# EAGLE design frankShield-v2 (EAGLE 7.5.0)
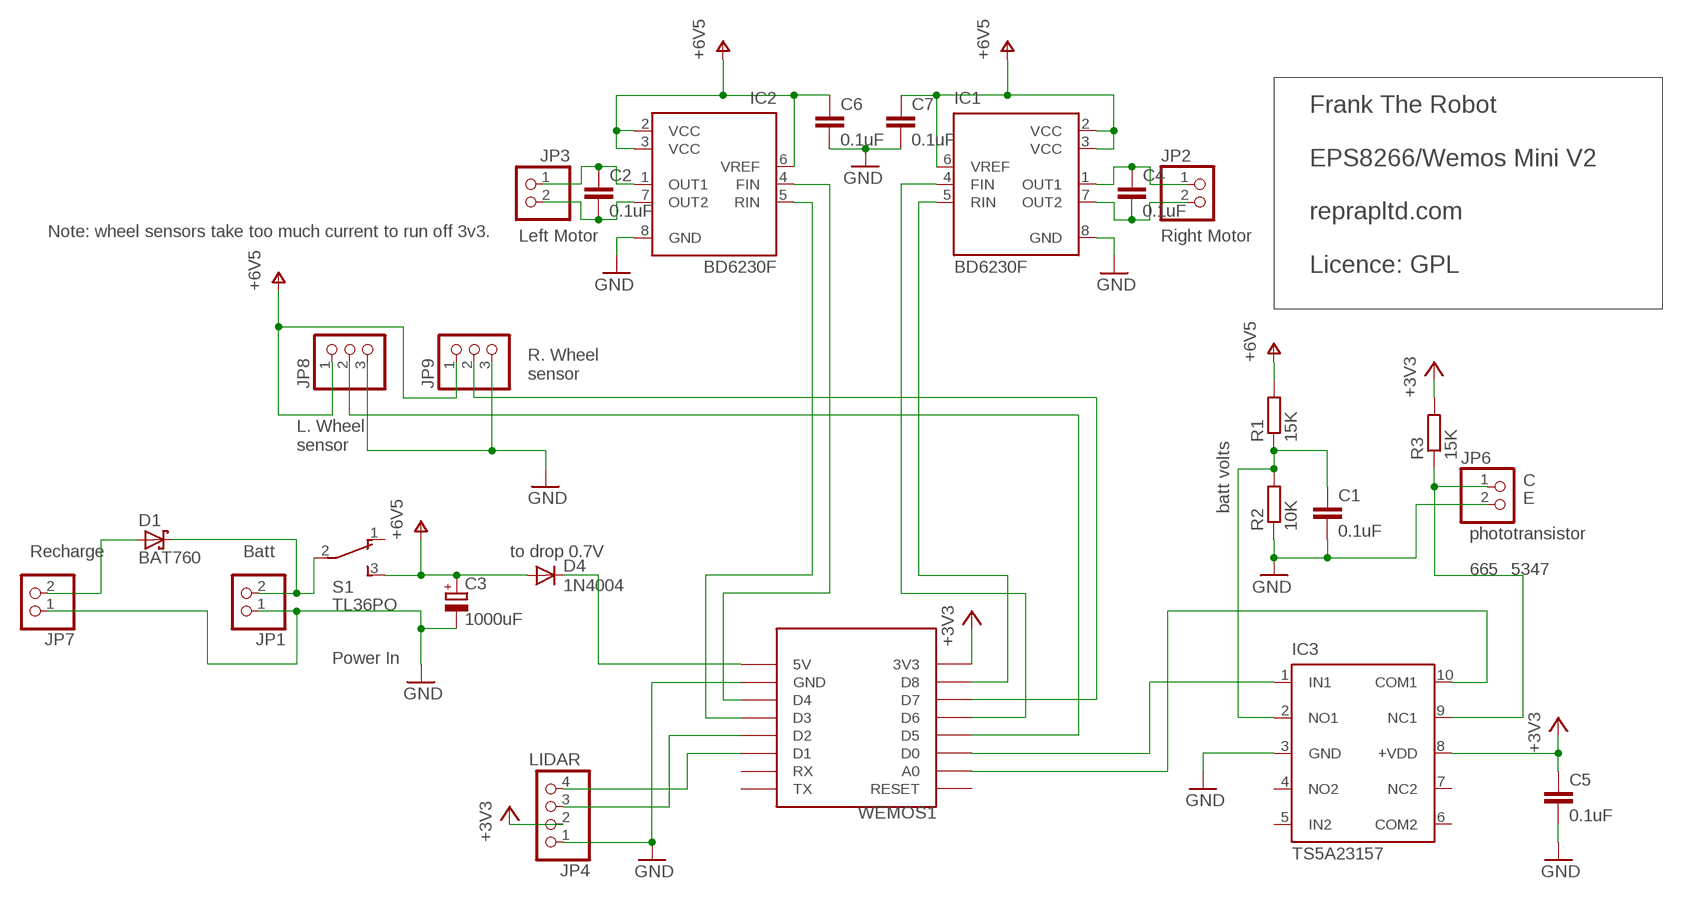
[diagram p0: schematic, sheet 1]

## Parts
C1  0.1uF  C-EUC0805  [C0805]
C2  0.1uF  C-EUC0805  [C0805]
C3  1000uF  CPOL-EUB45181B  [B45181B]
C4  0.1uF  C-EUC0805  [C0805]
C5  0.1uF  C-EUC0805  [C0805]
C6  0.1uF  C-EUC0805  [C0805]
C7  0.1uF  C-EUC0805  [C0805]
D1  BAT760  BAT60J  [SOD323_ST]
D4  1N4004  [DO41-10]
IC1  BD6230F  [SOP8]
IC2  BD6230F  [SOP8]
IC3  TS5A23157  [MSOP10]
JP1  PINHD-1X2  [1X02]
JP2  PINHD-1X2  [1X02]
JP3  PINHD-1X2  [1X02]
JP4  PINHD-1X4  [1X04]
JP6  PINHD-1X2  [1X02]
JP7  PINHD-1X2  [1X02]
JP8  PINHD-1X3  [1X03]
JP9  PINHD-1X3  [1X03]
R1  15K  R-EU_M0805  [M0805]
R2  10K  R-EU_M0805  [M0805]
R3  15K  R-EU_M0805  [M0805]
S1  TL36PO  [TL3XPO]
WEMOS1  WEMOS-D1-MINI  [WEMOS-D1-MINI]

## Nets
+3V3: C5.1 IC3.8(+VDD) JP4.2 R3.2 WEMOS1.3V3
GND: C1.2 C3.- C5.2 C6.2 C7.2 IC1.8(GND) IC2.8(GND) IC3.3(GND) JP1.1 JP4.1 JP6.2 JP7.1 JP8.3 JP9.3 R2.1 WEMOS1.GND
N$1: JP4.4 WEMOS1.D1
N$2: JP4.3 WEMOS1.D2
N$3: C2.1 IC2.1(OUT1) JP3.1
N$4: C2.2 IC2.7(OUT2) JP3.2
N$5: C4.1 IC1.1(OUT1) JP2.1
N$6: C4.2 IC1.7(OUT2) JP2.2
N$7: IC2.4(FIN) WEMOS1.D4
N$8: IC2.5(RIN) WEMOS1.D3
N$9: IC1.4(FIN) WEMOS1.D6
N$10: IC1.5(RIN) WEMOS1.D8
N$11: IC3.10(COM1) WEMOS1.A0
N$12: C1.1 IC3.2(NO1) R1.1 R2.2
N$13: D1.C JP1.2 S1.2(P)
N$14: IC3.9(NC1) JP6.1 R3.1
N$15: IC3.1(IN1) WEMOS1.D0
N$16: D1.A JP7.2
N$17: JP9.2 WEMOS1.D7
N$18: JP8.2 WEMOS1.D5
N$19: D4.C WEMOS1.5V
V+: C3.+ C6.1 C7.1 D4.A IC1.2(VCC) IC1.3(VCC) IC1.6(VREF) IC2.2(VCC) IC2.3(VCC) IC2.6(VREF) JP8.1 JP9.1 R1.2 S1.3(S) ; supply symbol labelled +6V5
Unconnected: IC3.4(NO2) IC3.5(IN2) IC3.6(COM2) S1.1(O) WEMOS1.RESET WEMOS1.RX WEMOS1.TX

## Notes on the sheet
- Note: wheel sensors take too much current to run off 3v3. | Left Motor | Right Motor
- Frank The Robot
  
  EPS8266/Wemos Mini V2
  
  reprapltd.com
  
  Licence: GPL
- R. Wheel
  sensor
- L. Wheel
  sensor
- C
- E
- batt volts
- phototransistor
- Recharge | Batt | to drop 0.7V
- 665‑5347
- Power In
- LIDAR

## Power pins joined to a net without a drawn wire
NC2: IC3.7(NC2)

## Library data of the parts
C1 C2 C4-C7 = rcl:C-EU: CAPACITOR, European symbol
C3 = rcl:CPOL-EU: POLARIZED CAPACITOR, European symbol
D1 = diode:BAT60J: Schottky barrier diode Source: www.st.com, BAT60J.pdf
D4 = diode:1N4004: DIODE general purpose rectifier, 1 A
IC1 IC2 = rohm:BD623*F: H-bridge driver for brush motors Source: http://www.rohm.com/products/databook/motor/pdf/bd623x_series-e.pdf; MPN: BD6230F-E2; OC_FARNELL: 1716264; OC_NEWARK: 15R0529
IC3 = reprapltd:TS5A23157: 2-Channel, 12-Bit ADC with I2C-Compatible Interface 10-Lead MSOP Source: http://www.analog.com/UploadedFiles/Data_Sheets/224965274AD7992_0.pdf; MPN: AD7992BRMZ-0; OC_FARNELL: 1078311; OC_NEWARK: 31M4422
JP1-JP3 JP6 JP7 = pinhead:PINHD-1X2: PIN HEADER
JP4 = pinhead:PINHD-1X4: PIN HEADER
JP8 JP9 = pinhead:PINHD-1X3: PIN HEADER
R1-R3 = rcl:R-EU_: RESISTOR, European symbol
S1 = switch:TL36PO: TINY SWITCH ON - ON Source: http://www2.produktinfo.conrad.com/datenblaetter/700000-724999/705152-da-01-de-Subminiaturschalter_TL_36YO.pdf
WEMOS1 = esp8266modules:WEMOS-D1-MINI: WeMos.cc D1 mini ESP8266 module

## Board
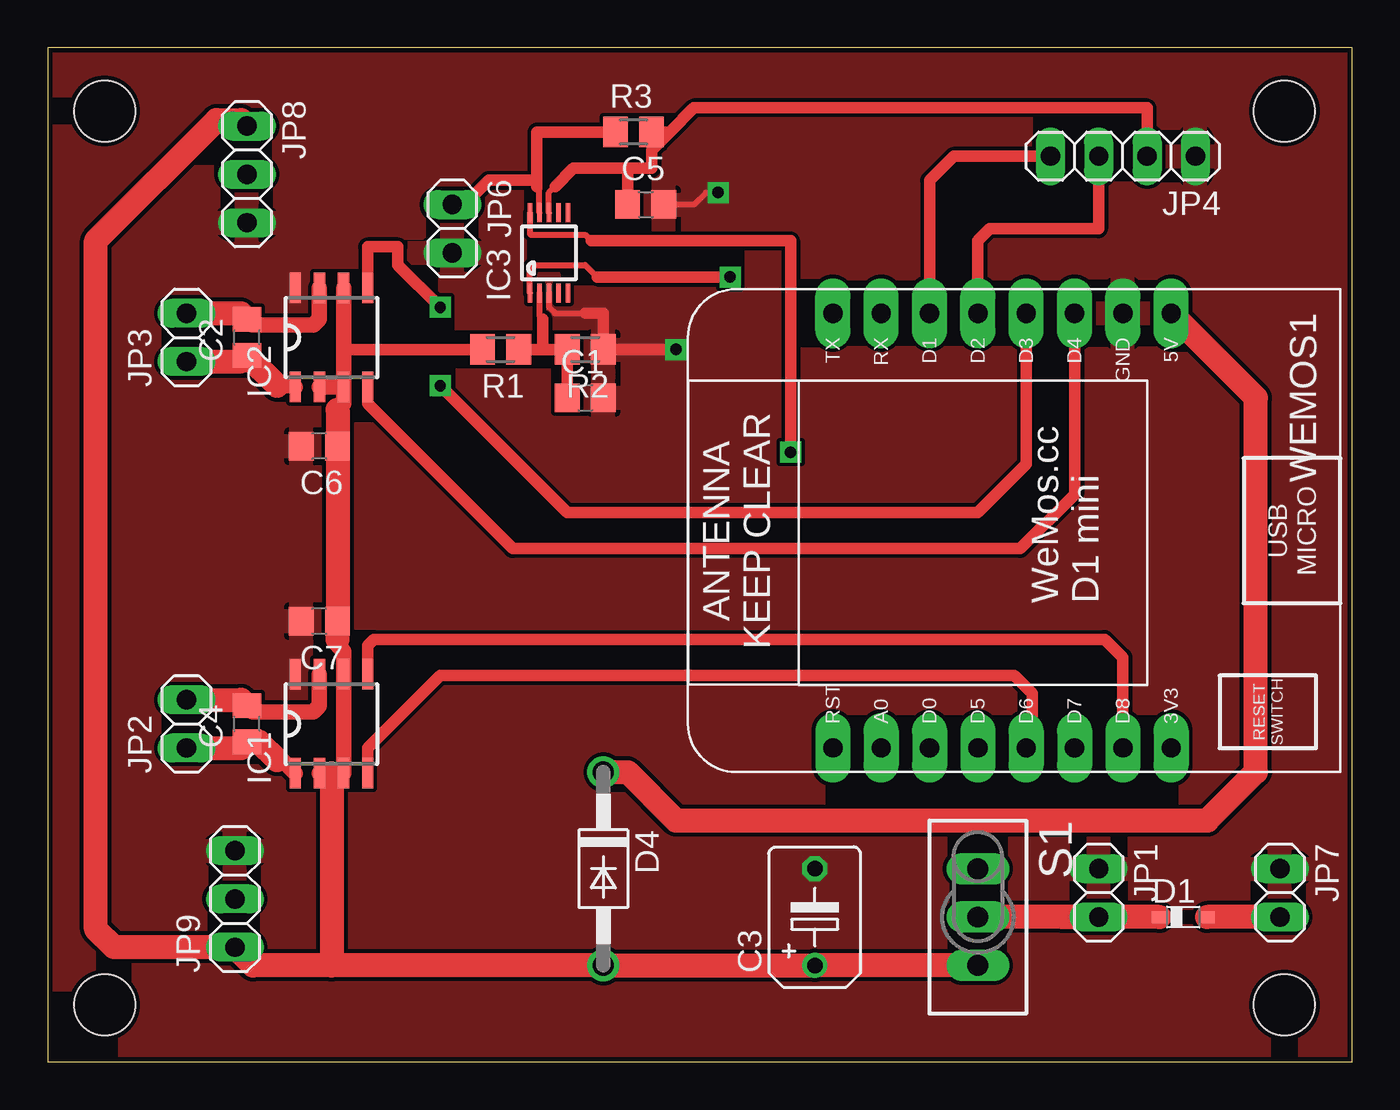
[diagram p1: board, top side]
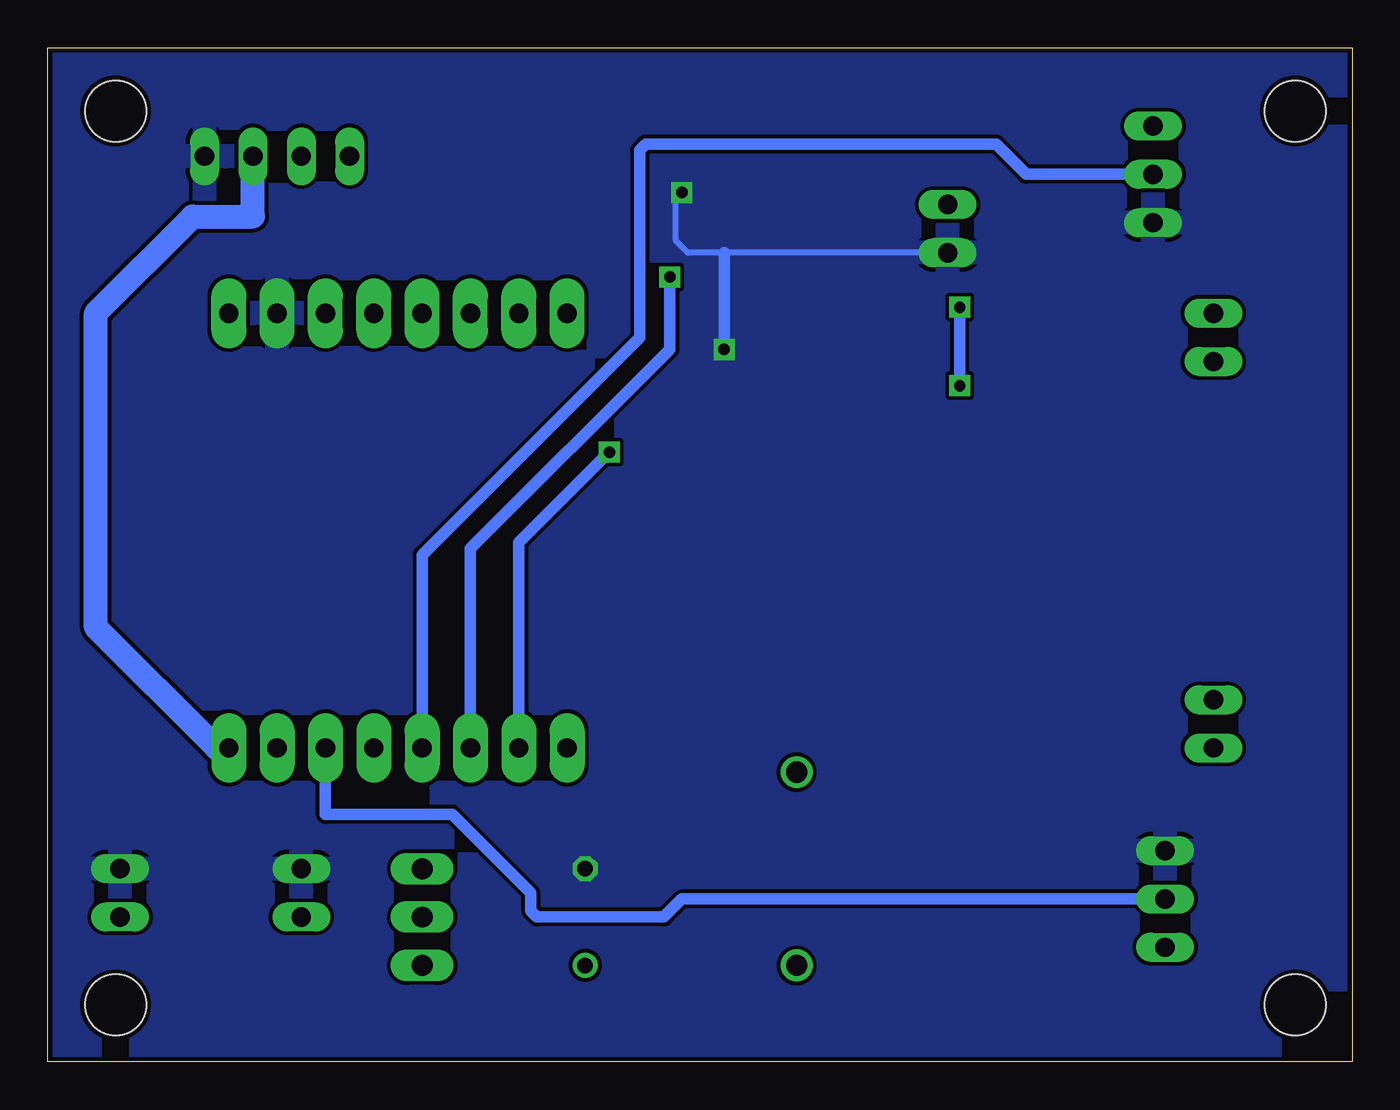
[diagram p2: board, bottom side, seen from below]

Size 68.58 x 53.34 mm. Coordinates in mm from the lower left corner, seen from the top.
Outline: 68.57,53.33 68.57,0 0,0 0,53.33
Outline: 68.58,53.34 0,53.34
Copper layers (1*16): Top 0.035mm / dielectric 1.5mm / Bottom 0.035mm
Design rules "pcbtrain": minimum track width 0.2mm, minimum drill 0.4mm, track to track 0.2mm, track to pad 0.2mm, pad to pad 0.2mm, via to via 0.2mm, smd to smd 0mil, copper to edge 10mil, drill to drill 0.2mm, minimum pad ring 10mil, minimum via ring 10mil, stop-mask expansion 0.125mm, vias tented up to drill 0mil, thermal gap 10mil
Holes 3.2 mm at 3,3 3,50 65,50 65,3

### Footprints (pad centres in the part's own frame; a part is rotated, then mirrored left to right if it is on the bottom)
C0805 = smd 1.3 x 1.5: 1 -0.95,0; 2 0.95,0
B45181B = drill 0.813: + -2.54,0 | drill 0.813 octagon: - 2.54,0
SOD323_ST = smd 0.8 x 0.6: A 1.25,0; C -1.25,0
DO41-10 = drill 1.118: A 5.08,0; C -5.08,0
SOP8 = smd 0.6 x 1.6: 1 -1.905,-2.6; 2 -0.635,-2.6; 3 0.635,-2.6; 4 1.905,-2.6; 5 1.905,2.6; 6 0.635,2.6; 7 -0.635,2.6; 8 -1.905,2.6
MSOP10 = smd 0.25 x 1: 1 -1,-2.113; 2 -0.5,-2.113; 3 0,-2.113; 4 0.5,-2.113; 5 1,-2.113; 6 1,2.113; 7 0.5,2.113; 8 0,2.113; 9 -0.5,2.113; 10 -1,2.113
1X02 = drill 1.016 long: 1 -1.27,0; 2 1.27,0
1X04 = drill 1.016 long: 1 -3.81,0; 2 -1.27,0; 3 1.27,0; 4 3.81,0
1X03 = drill 1.016 long: 1 -2.54,0; 2 0,0; 3 2.54,0
M0805 = smd 1.3 x 1.6: 1 -0.95,0; 2 0.95,0
TL3XPO = drill 1.1 pad 1.422 long: 1 -2.54,0; 2 0,0; 3 2.54,0
WEMOS-D1-MINI = drill 1.016 pad 1.829 long: 3V3 -10.16,-10.16; 5V 12.7,-10.16; A0 -10.16,5.08; D0 -10.16,2.54; D1 12.7,2.54; D2 12.7,0; D3 12.7,-2.54; D4 12.7,-5.08; D5 -10.16,0; D6 -10.16,-2.54; D7 -10.16,-5.08; D8 -10.16,-7.62; GND 12.7,-7.62; RESET -10.16,7.62; RX 12.7,5.08; TX 12.7,7.62

### Placement (x,y rotation side)
C1  28.26,34.92 0 top
C2  10.48,38.1 90 top
C3  40.32,7.62 90 top
C4  10.48,17.78 90 top
C5  31.43,45.09 0 top
C6  14.29,32.38 180 top
C7  14.29,23.18 180 top
D1  59.69,7.62 0 top
D4  29.21,10.16 270 top
IC1  14.92,17.78 0 top
IC2  14.92,38.1 0 top
IC3  26.35,42.55 0 top
JP1  55.24,8.89 270 top
JP2  7.3,17.78 90 top
JP3  7.3,38.1 90 top
JP4  56.52,47.62 180 top
JP6  21.27,43.81 270 top
JP7  64.77,8.89 270 top
JP8  10.48,46.67 270 top
JP9  9.84,8.57 90 top
R1  23.81,37.47 180 top
R2  28.26,37.47 180 top
R3  30.8,48.9 0 top
S1  48.9,7.62 270 top
WEMOS1  48.9,26.67 90 top

### Tracks (layer width: path | path; a pad name or v marks a point on that pad's centre or on a via)
+3V3
  Top 0.305: IC3.8 26.35,45.72 26.67,46.04
  Top 0.61: JP4.2 57.78,50.16 33.97,50.16 32.7,48.9 | 32.7,48.9 31.75,47.94 31.75,46.99 | 31.75,46.99 30.48,46.99 C5.1 | R3.2 32.7,48.9 | 31.75,46.99 27.62,46.99 26.67,46.04
  Bottom 1.27: WEMOS1.3V3 59.69,16.51 66.04,22.86 66.04,39.37 60.96,44.45 57.78,44.45 JP4.2
GND  (via drill 0.6)
  Top 0.305: IC3.3 26.35,39.69 26.67,39.37 28.26,39.37 28.57,39.37 | v35.24,45.72 34.61,45.72 33.97,45.09 C5.2
  Top 0.61: 28.26,39.37 29.21,39.37 R2.1 v33.02,37.47
  Bottom 0.305: JP6.2 33.02,42.55 34.92,42.55 35.56,43.18 35.56,45.4 v35.24,45.72
  Bottom 0.61: 33.02,42.55 v33.02,37.47
  pour Top: 0,53.34 68.58,53.34 68.58,0 0,0
  pour Bottom: 0,53.34 68.58,53.34 68.58,0 0,0
N$1
  Top 0.61: JP4.4 47.62,47.62 46.35,46.35 WEMOS1.D1
N$2
  Top 0.61: JP4.3 55.24,43.81 49.53,43.81 48.9,43.18 WEMOS1.D2
N$3
  Top 0.813: 12.06,35.56 12.96,35.56 IC2.1
  Top 1.27: JP3.1 10.16,36.83 C2.1 12.06,35.56
N$4
  Top 0.813: IC2.7 14.29,39.05 13.97,38.73 10.79,38.73 C2.2
  Top 1.27: JP3.2 10.16,39.37 C2.2
N$5
  Top 0.813: 12.06,15.88 12.32,15.88 IC1.1
  Top 1.27: JP2.1 10.16,16.51 C4.1 11.11,16.83 12.06,15.88
N$6
  Top 0.813: IC1.7 14.29,18.73 13.97,18.41 10.79,18.41 C4.2
  Top 1.27: JP2.2 10.16,19.05 C4.2
N$7
  Top 0.61: IC2.4 16.83,34.61 24.45,26.99 51.12,26.99 53.98,29.84 WEMOS1.D4
N$8  (via drill 0.6)
  Top 0.61: WEMOS1.D3 51.44,31.43 48.9,28.89 27.3,28.89 v20.64,35.56 | v20.64,39.69 18.41,41.91 18.41,42.86 16.83,42.86 IC2.5
  Bottom 0.61: v20.64,35.56 v20.64,39.69
N$9
  Top 0.61: IC1.4 16.83,16.51 20.64,20.32 50.8,20.32 51.75,19.37 51.75,16.83 WEMOS1.D6
N$10
  Top 0.61: IC1.5 16.83,21.91 17.14,22.23 55.56,22.23 56.52,21.27 WEMOS1.D8
N$11  (via drill 0.6)
  Top 0.305: IC3.10 25.35,43.55 25.4,43.5 28.26,43.5 28.57,43.18
  Top 0.61: 28.57,43.18 39.05,43.18 v39.05,32.07
  Bottom 0.61: v39.05,32.07 43.81,27.3 WEMOS1.A0
N$12
  Top 0.305: IC3.2 25.85,39.23 26.04,39.05
  Top 0.61: C1.1 R2.2 26.04,37.47 | 26.04,37.47 R1.1 | 26.04,39.05 26.04,37.47
N$13
  Top 1.27: 53.34,7.62 JP1.2 D1.C S1.2
N$14
  Top 0.305: IC3.9 25.85,45.9 25.72,46.04
  Top 0.61: JP6.1 21.91,45.09 23.18,46.35 25.72,46.35 | 25.72,46.35 25.72,46.04 | R3.1 25.72,48.9 25.72,46.35
N$15  (via drill 0.6)
  Top 0.305: IC3.1 25.35,41.86 25.4,41.91 28.26,41.91 28.89,41.27
  Top 0.61: 28.89,41.27 v35.88,41.27
  Bottom 0.61: v35.88,41.27 35.88,37.47 46.35,26.99 WEMOS1.D0
N$16
  Top 1.27: JP7.2 D1.A
N$17
  Bottom 0.61: JP9.2 35.24,8.57 36.2,7.62 42.86,7.62 43.18,7.94 43.18,8.89 47.31,13.02 53.98,13.02 WEMOS1.D7
N$18
  Bottom 0.61: JP8.2 17.14,46.67 18.73,48.26 37.15,48.26 37.47,47.94 37.47,38.1 48.9,26.67 WEMOS1.D5
N$19
  Top 1.27: D4.C 30.48,15.24 33.02,12.7 60.96,12.7 63.5,15.24 63.5,34.92 WEMOS1.5V
V+
  Top 0.61: R1.2 15.56,37.47
  Top 0.813: IC2.6 15.56,37.47 IC2.3 | IC1.2 14.93,15.18 IC1.3 IC1.6 15.56,21.59 15.24,21.91 15.24,22.23 | IC2.3 IC2.2 | IC2.3 15.56,34.61 15.24,34.29
  Top 1.27: S1.3 C3.+ D4.A 14.92,5.08 | 14.92,5.08 10.79,5.08 JP9.1 3.49,6.03 2.54,6.99 2.54,43.18 8.89,49.53 10.16,49.53 JP8.1 | 15.24,34.29 C6.1 | C6.1 | 15.24,22.23 C7.1 C6.1 | 14.93,15.18 14.93,5.09 14.92,5.08

### Text on the board
tValues: LIDAR | C | EPS8266/Arduino Shield V1.1 / reprapltd.com / Mechanics & software: Sally Bowyer / Electronics: Adrian Bowyer / Licence - GPL | SDA | SCL | E | photo | G | +3V3 | Left / Motor | Right / Motor | Frank The Robot | R. sense | L. sense | + | + | - | - | sig | +batt | G | charge | + | Batt | - | +batt | sig | G